# Altium schematic sheet Sheet1.SchDoc
size A4
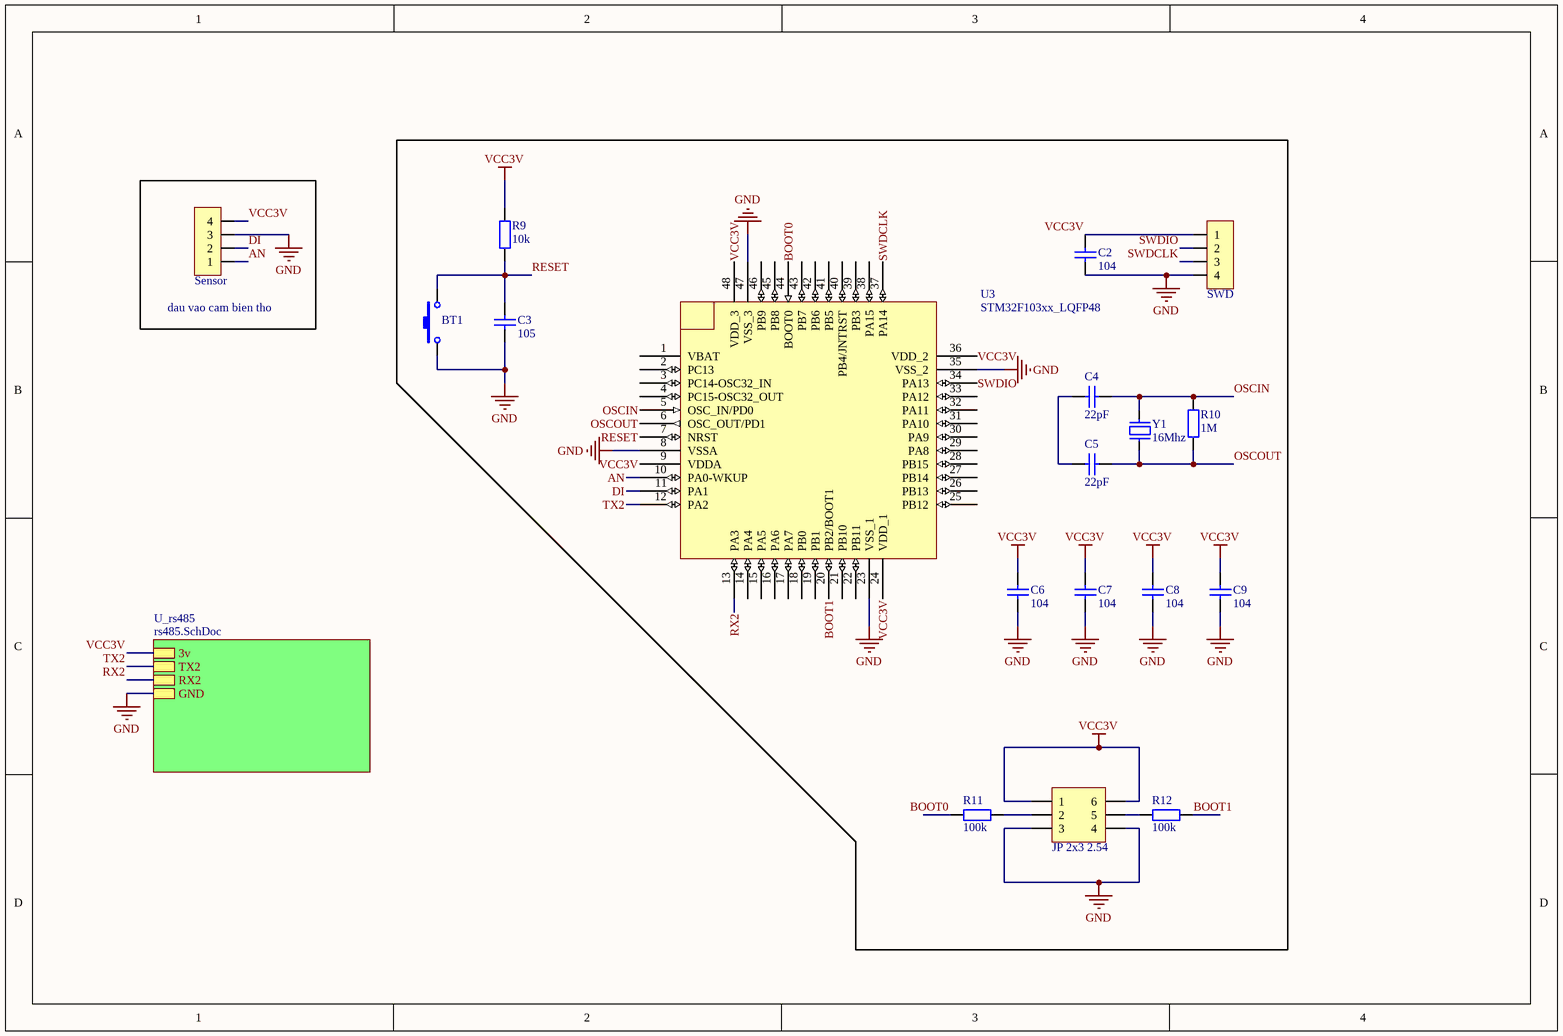
[diagram p0: Sheet1.SchDoc]

## Parts
BT1  Nut Nhan 2 Chan SMD 3x6x2.5  [Nut Nhan 2 Chan SMD 3x6x2.5]  (value not drawn)
C2  104  [tu 0603]
C3  105  [tu 0603]
C4  22pF  [tu 0603]
C5  22pF  [tu 0603]
C6  104  [tu 0603]
C7  104  [tu 0603]
C8  104  [tu 0603]
C9  104  [tu 0603]
JP1  Sensor  [JP 1x4 CC]
JP2  SWD  [JP 1x4 DT]
JP3  JP 2x3 2.54  [JP 2x3 DT]
R9  10k  [tro smd 0603]
R10  1M  [tro smd 0603]
R11  100k  [tro smd 0603]
R12  100k  [tro smd 0603]
U3  STM32F103xx_LQFP48  [STM32_LQPF48]
Y1  16Mhz  [Thach Anh 2 chan cam]

## Blocks framed on the sheet
dau vao cam bien tho: JP1

## Sub-sheets
U_rs485 = rs485.SchDoc: 3v, TX2, RX2, GND

## Nets
GND: BT1.1 C2.2 C3.2 C6.2 C7.2 C8.2 C9.2 JP1.3 JP2.4 JP3.3 JP3.4 U3.8(VSSA) U3.23(VSS_1) U3.35(VSS_2) U3.47(VSS_3) ; sheet U_rs485/GND
VCC3V: C2.1 C6.1 C7.1 C8.1 C9.1 JP1.4 JP2.1 JP3.1 JP3.6 R9.2 U3.9(VDDA) U3.24(VDD_1) U3.36(VDD_2) U3.48(VDD_3) ; sheet U_rs485/3v
AN: JP1.1 U3.10(PA0-WKUP)
BOOT0: R11.1 U3.44(BOOT0)
BOOT1: R12.2 U3.20(PB2/BOOT1)
DI: JP1.2 U3.11(PA1)
OSCIN: C4.1 R10.2 U3.5(OSC_IN/PD0) Y1.2
OSCOUT: C5.1 R10.1 U3.6(OSC_OUT/PD1) Y1.1
RESET: BT1.2 C3.1 R9.1 U3.7(NRST)
RX2: U3.13(PA3) ; sheet U_rs485/RX2
SWDCLK: JP2.3 U3.37(PA14)
SWDIO: JP2.2 U3.34(PA13)
TX2: U3.12(PA2) ; sheet U_rs485/TX2
NetC4_2: C4.2 C5.2
NetJP3_2: JP3.2 R11.2
NetJP3_5: JP3.5 R12.1

Not connected (* = marked no-connect by the designer): U3 1(VBAT) 2(PC13) 3(PC14-OSC32_IN) 4(PC15-OSC32_OUT) 14(PA4) 15(PA5) 16(PA6) 17(PA7) 18(PB0) 19(PB1) 21(PB10) 22(PB11) 25(PB12) 26(PB13) 27(PB14) 28(PB15) 29(PA8) 30(PA9) 31(PA10) 32(PA11) 33(PA12) 38(PA15) 39(PB3) 40(PB4/JNTRST) 41(PB5) 42(PB6) 43(PB7) 45(PB8) 46(PB9)

## Library data of the parts
BT1 = Nut Nhan 2 Chan SMD 3x6x2.5: Ma_Hang: MH001036; Ten: Nút Nhấn 2 Chân 3x6x2.5MM SMD
C2 C6-C9 = Tu 0603 104 50V 10%: Dán; Don_Vi: Con; So_Chan: 2; Ten_Linh_Kien: Tụ 0603 104-100nF 10% 50V; Ma_Hang: MH004568; Chung_Loai: Dán; Kieu_Chan: *
C3 = Tu 0603 105 16V 20%: Dán; Don_Vi: Con; So_Chan: 2; Ten_Linh_Kien: Tụ 0603 105-1uF 20% 16V; Ma_Hang: MH004574; Chung_Loai: Dán; Kieu_Chan: *
C4 C5 = Tu 0603 22pF 50V 10%: Dán; Don_Vi: Con; So_Chan: 2; Ten_Linh_Kien: Tụ 0603 22pF 50V 10%; Ma_Hang: MH004570; Chung_Loai: Dán; Kieu_Chan: *
JP1 = JP 1x4 2.54 Cai Cong: Cắm; Ten_Linh_Kien: Jump Đơn Cái 2.54MM 1x40P Cong; Don_Vi: Con; Ma_Hang: MH001265; Ghi_Chu: *; Kieu_Chan: *; Chung_Loai: Cắm
JP2 = JP 1x4 2.54 Duc Thang: Cắm; Ten_Linh_Kien: Jump Đơn Đực 2.54MM 1x40P Thẳng 11MM; Don_Vi: Con; Ma_Hang: MH000903; Ghi_Chu: *; Kieu_Chan: *; Chung_Loai: Cắm
JP3 = JP 2x3 2.54 Duc Thang: Cắm; Ten_Linh_Kien: Jump Đôi Đực 2.54MM 2x40P Thẳng 11MM; Don_Vi: Con; Ma_Hang: MH002686; Ghi_Chu: *; Kieu_Chan: *; Chung_Loai: Cắm
R9 = Tro 0603 5% 10k: Dán; Don_Vi: Con; So_Chan: 2; Ten_Linh_Kien: Trở 0603 5% 10k; Ma_Hang: MH006316; Chung_Loai: Dán; Kieu_Chan: *
R10 = Tro 0603 5% 1M: Dán; Don_Vi: Con; So_Chan: 2; Ten_Linh_Kien: Trở 0603 5% 1M; Ma_Hang: MH006909; Chung_Loai: Dán; Kieu_Chan: *
R11 R12 = Tro 0603 5% 100k: Dán; So_Chan: 2; Ten_Linh_Kien: Trở 0603 5% 100k; Ma_Hang: MH006314; Don_Vi: Con; Chung_Loai: Dán; Kieu_Chan: *
Y1 = Thach Anh 2 chan Cam: Crystal For all Crystal 2pin.; Value: 4Mhz
U3 = STM32F103xx_LQFP48: Published: 30-May-2008; DatasheetVersion: rev6, Mar-2008; PackageVersion: Mar-2008; PackageReference: LQFP48; Publisher: Altium Limited; PackageDescription: 48-Pin Low-Profile Quad Flat Pack, 7 x 7 mm Body, 0.5 mm Pitch (LQFP48); ComponentLink1Description: Manufacturer Link; ComponentLink1URL: www.st.com/stm32; ComponentLink2Description: Datasheet; ComponentLink2URL: http://www.st.com/stonline/products/literature/ds/13587.pdf